# EAGLE schematic Drum_Machine (EAGLE 9.0.0)
REV: 00

## Sheet 1 of 7: PocketBeagle Connections
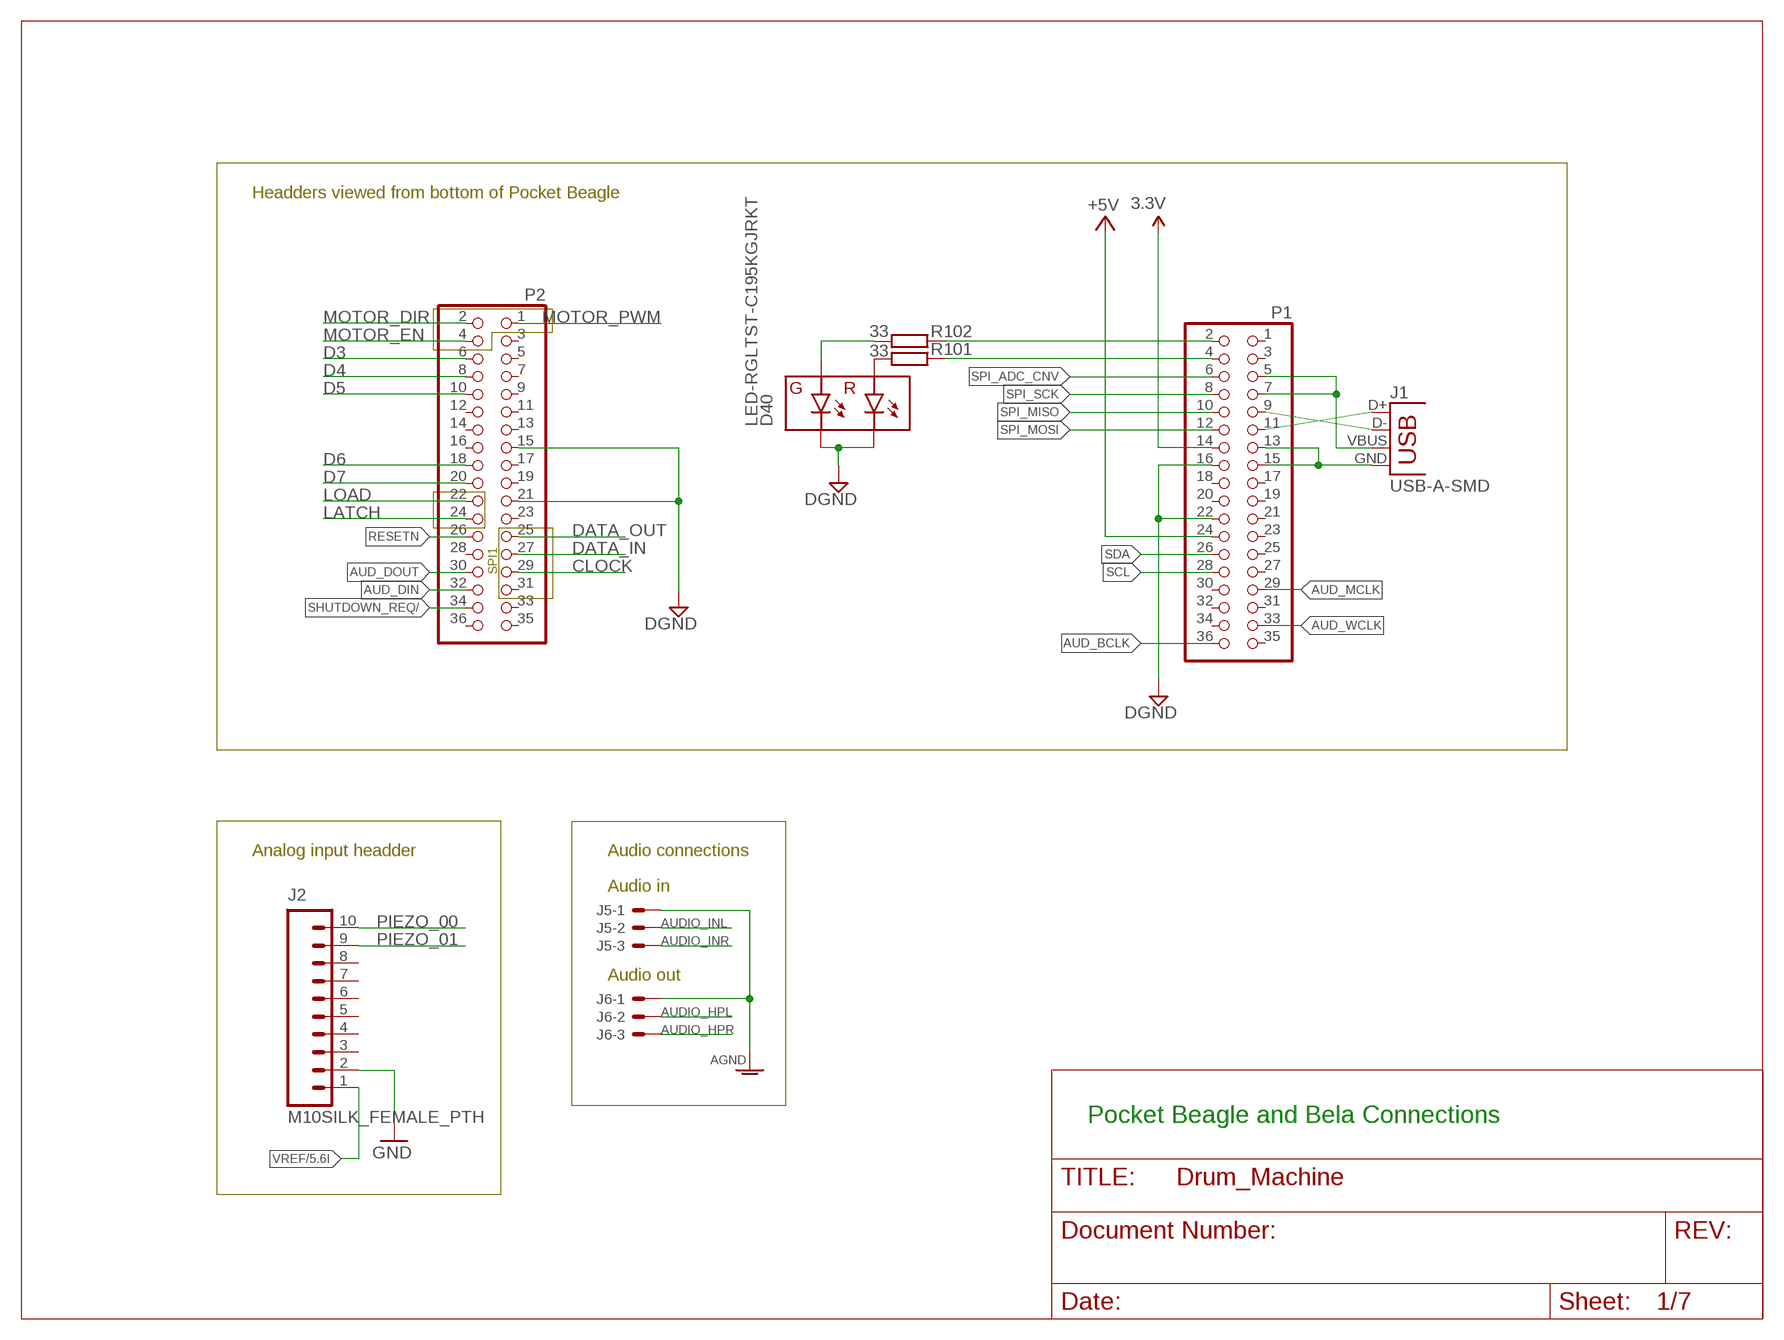
[diagram p0: schematic, sheet 1]

### Parts
D40  LED-RGLTST-C195KGJRKT  [LTST-C195KGJRKT]
J1  USB-A-SMD  [USB-A-S-NOSILK-FEMALE]
J2  M10SILK_FEMALE_PTH  [1X10]
J5  22-23-2031  [22-23-2031]
J6  22-23-2031  [22-23-2031]
P1  PINHD-2X18  [2X18]
P2  PINHD-2X18  [2X18]
R101  33  R-EU_R0603  [R0603]
R102  33  R-EU_R0603  [R0603]

### Nets
3.3V: P1.14 ; also sheet 2,3,4
+5V_SYS: P1.24 ; supply symbol labelled +5V
AUD_BCLK: P1.36
AUD_DIN: P2.32
AUD_DOUT: P2.30
AUD_MCLK: P1.29
AUD_WCLK: P1.33
AUDIO_HPL: J6.2
AUDIO_HPR: J6.3
AUDIO_INL: J5.2
AUDIO_INR: J5.3
CLOCK: P2.29 ; also sheet 2,3,4
D3: P2.6
D4: P2.8
D5: P2.10
D6: P2.18
D7: P2.20
DATA_IN: P2.27
DATA_OUT: P2.25 ; also sheet 2
GND: D40.P$3(GC) D40.P$4(RC) J2.2 J5.1 J6.1 P1.16 P1.22 P2.15 P2.21 ; supply symbol labelled DGND, AGND ; also sheet 2,3,4,5,6
LATCH: P2.24 ; also sheet 2,3
LOAD: P2.22
MOTOR_DIR: P2.2
MOTOR_EN: P2.4
MOTOR_PWM: P2.1
N$134: D40.P$2(RA) R101.2
N$135: D40.P$1(GA) R102.2
N$136: P1.4 R101.1
N$137: P1.2 R102.1
PIEZO_00: J2.10 ; also sheet 5
PIEZO_01: J2.9 ; also sheet 5
RESETN: P2.26
SCL: P1.28
SDA: P1.26
SHUTDOWN_REQ/: P2.34
SPI_ADC_CNV: P1.6
SPI_MISO: P1.10
SPI_MOSI: P1.12
SPI_SCK: P1.8
USB_DM1: J1.D- P1.9
USB_DP1: J1.D+ P1.11
USB_VBUS1: J1.VBUS P1.5 P1.7
USBGND1: J1.GND P1.13 P1.15
VREF: J2.1 ; also sheet 5
Unconnected: J2.3 J2.4 J2.5 J2.6 J2.7 J2.8 P1.1 P1.3 P1.17 P1.18 P1.19 P1.20 P1.21 P1.23 P1.25 P1.27 P1.30 P1.31 P1.32 P1.34 P1.35 P2.3 P2.5 P2.7 P2.9 P2.11 P2.12 P2.13 P2.14 P2.16 P2.17 P2.19 P2.23 P2.28 P2.31 P2.33 P2.35 P2.36

### Notes on the sheet
- Headders viewed from bottom of Pocket Beagle
- SPI1
- Analog input headder | Audio connections
- Audio in
- Audio out
- Pocket Beagle and Bela Connections

## Sheet 2 of 7: LED Matrix
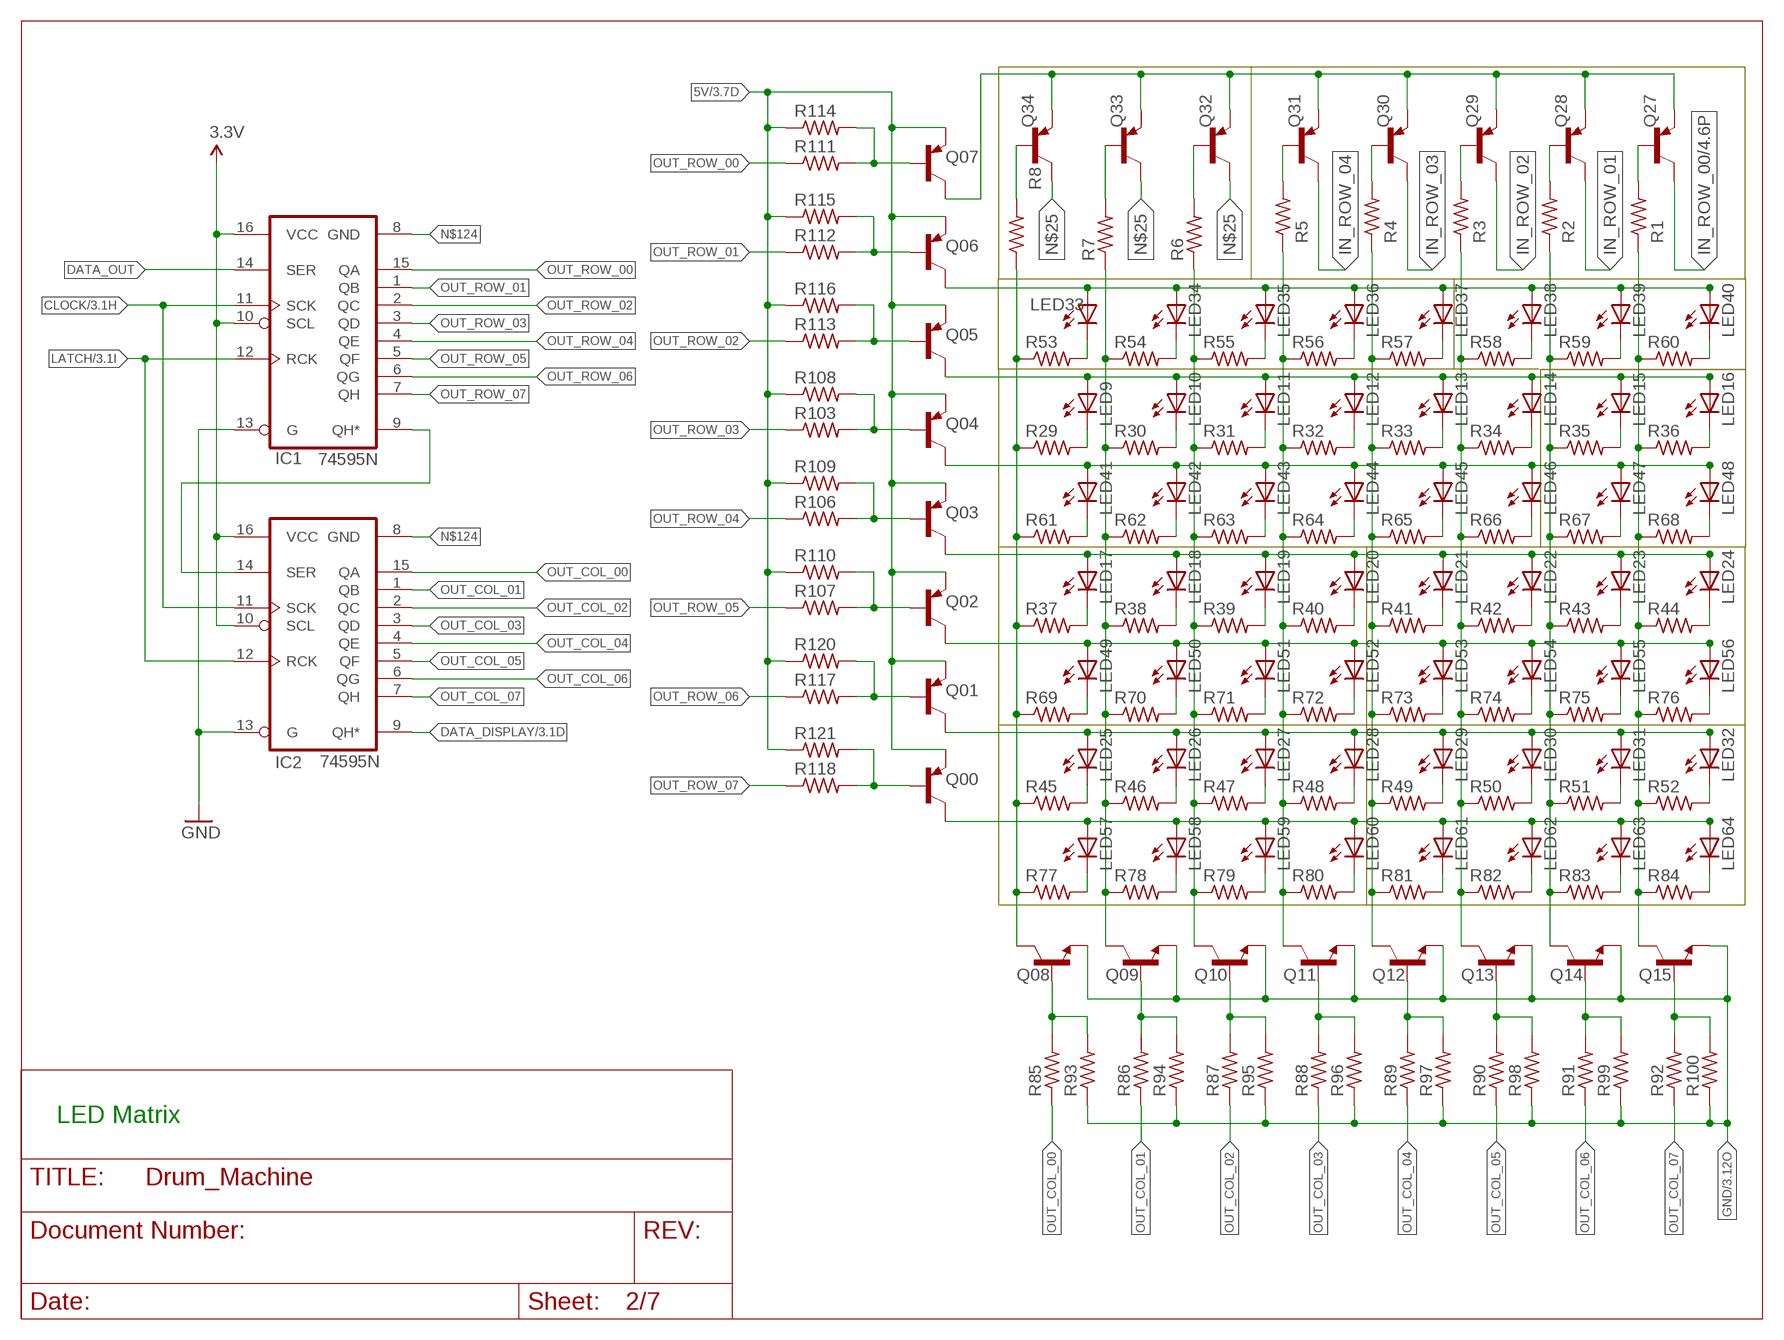
[diagram p1: schematic, sheet 2]

### Parts
IC1  74595N  [DIL16]
IC2  74595N  [DIL16]
LED9  LED5MM  [LED5MM]
LED10  LED5MM  [LED5MM]
LED11  LED5MM  [LED5MM]
LED12  LED5MM  [LED5MM]
LED13  LED5MM  [LED5MM]
LED14  LED5MM  [LED5MM]
LED15  LED5MM  [LED5MM]
LED16  LED5MM  [LED5MM]
LED17  LED5MM  [LED5MM]
LED18  LED5MM  [LED5MM]
LED19  LED5MM  [LED5MM]
LED20  LED5MM  [LED5MM]
LED21  LED5MM  [LED5MM]
LED22  LED5MM  [LED5MM]
LED23  LED5MM  [LED5MM]
LED24  LED5MM  [LED5MM]
LED25  LED5MM  [LED5MM]
LED26  LED5MM  [LED5MM]
LED27  LED5MM  [LED5MM]
LED28  LED5MM  [LED5MM]
LED29  LED5MM  [LED5MM]
LED30  LED5MM  [LED5MM]
LED31  LED5MM  [LED5MM]
LED32  LED5MM  [LED5MM]
LED33  LED5MM  [LED5MM]
LED34  LED5MM  [LED5MM]
LED35  LED5MM  [LED5MM]
LED36  LED5MM  [LED5MM]
LED37  LED5MM  [LED5MM]
LED38  LED5MM  [LED5MM]
LED39  LED5MM  [LED5MM]
LED40  LED5MM  [LED5MM]
LED41  LED5MM  [LED5MM]
LED42  LED5MM  [LED5MM]
LED43  LED5MM  [LED5MM]
LED44  LED5MM  [LED5MM]
LED45  LED5MM  [LED5MM]
LED46  LED5MM  [LED5MM]
LED47  LED5MM  [LED5MM]
LED48  LED5MM  [LED5MM]
LED49  LED5MM  [LED5MM]
LED50  LED5MM  [LED5MM]
LED51  LED5MM  [LED5MM]
LED52  LED5MM  [LED5MM]
LED53  LED5MM  [LED5MM]
LED54  LED5MM  [LED5MM]
LED55  LED5MM  [LED5MM]
LED56  LED5MM  [LED5MM]
LED57  LED5MM  [LED5MM]
LED58  LED5MM  [LED5MM]
LED59  LED5MM  [LED5MM]
LED60  LED5MM  [LED5MM]
LED61  LED5MM  [LED5MM]
LED62  LED5MM  [LED5MM]
LED63  LED5MM  [LED5MM]
LED64  LED5MM  [LED5MM]
Q00  BC857CSMD  [SOT23-BEC]
Q01  BC857CSMD  [SOT23-BEC]
Q02  BC857CSMD  [SOT23-BEC]
Q03  BC857CSMD  [SOT23-BEC]
Q04  BC857CSMD  [SOT23-BEC]
Q05  BC857CSMD  [SOT23-BEC]
Q06  BC857CSMD  [SOT23-BEC]
Q07  BC857CSMD  [SOT23-BEC]
Q08  2N4401-NPN-TO92-EBC  [TO92-EBC]
Q09  2N4401-NPN-TO92-EBC  [TO92-EBC]
Q10  2N4401-NPN-TO92-EBC  [TO92-EBC]
Q11  2N4401-NPN-TO92-EBC  [TO92-EBC]
Q12  2N4401-NPN-TO92-EBC  [TO92-EBC]
Q13  2N4401-NPN-TO92-EBC  [TO92-EBC]
Q14  2N4401-NPN-TO92-EBC  [TO92-EBC]
Q15  2N4401-NPN-TO92-EBC  [TO92-EBC]
Q27  BC857CSMD  [SOT23-BEC]
Q28  BC857CSMD  [SOT23-BEC]
Q29  BC857CSMD  [SOT23-BEC]
Q30  BC857CSMD  [SOT23-BEC]
Q31  BC857CSMD  [SOT23-BEC]
Q32  BC857CSMD  [SOT23-BEC]
Q33  BC857CSMD  [SOT23-BEC]
Q34  BC857CSMD  [SOT23-BEC]
R1  R-US_0309/10  [0309/10]
R2  R-US_0309/10  [0309/10]
R3  R-US_0309/10  [0309/10]
R4  R-US_0309/10  [0309/10]
R5  R-US_0309/10  [0309/10]
R6  R-US_0309/10  [0309/10]
R7  R-US_0309/10  [0309/10]
R8  R-US_0309/10  [0309/10]
R29  R-US_0309/10  [0309/10]
R30  R-US_0309/10  [0309/10]
R31  R-US_0309/10  [0309/10]
R32  R-US_0309/10  [0309/10]
R33  R-US_0309/10  [0309/10]
R34  R-US_0309/10  [0309/10]
R35  R-US_0309/10  [0309/10]
R36  R-US_0309/10  [0309/10]
R37  R-US_0309/10  [0309/10]
R38  R-US_0309/10  [0309/10]
R39  R-US_0309/10  [0309/10]
R40  R-US_0309/10  [0309/10]
R41  R-US_0309/10  [0309/10]
R42  R-US_0309/10  [0309/10]
R43  R-US_0309/10  [0309/10]
R44  R-US_0309/10  [0309/10]
R45  R-US_0309/10  [0309/10]
R46  R-US_0309/10  [0309/10]
R47  R-US_0309/10  [0309/10]
R48  R-US_0309/10  [0309/10]
R49  R-US_0309/10  [0309/10]
R50  R-US_0309/10  [0309/10]
R51  R-US_0309/10  [0309/10]
R52  R-US_0309/10  [0309/10]
R53  R-US_0309/10  [0309/10]
R54  R-US_0309/10  [0309/10]
R55  R-US_0309/10  [0309/10]
R56  R-US_0309/10  [0309/10]
R57  R-US_0309/10  [0309/10]
R58  R-US_0309/10  [0309/10]
R59  R-US_0309/10  [0309/10]
R60  R-US_0309/10  [0309/10]
R61  R-US_0309/10  [0309/10]
R62  R-US_0309/10  [0309/10]
R63  R-US_0309/10  [0309/10]
R64  R-US_0309/10  [0309/10]
R65  R-US_0309/10  [0309/10]
R66  R-US_0309/10  [0309/10]
R67  R-US_0309/10  [0309/10]
R68  R-US_0309/10  [0309/10]
R69  R-US_0309/10  [0309/10]
R70  R-US_0309/10  [0309/10]
R71  R-US_0309/10  [0309/10]
R72  R-US_0309/10  [0309/10]
R73  R-US_0309/10  [0309/10]
R74  R-US_0309/10  [0309/10]
R75  R-US_0309/10  [0309/10]
R76  R-US_0309/10  [0309/10]
R77  R-US_0309/10  [0309/10]
R78  R-US_0309/10  [0309/10]
R79  R-US_0309/10  [0309/10]
R80  R-US_0309/10  [0309/10]
R81  R-US_0309/10  [0309/10]
R82  R-US_0309/10  [0309/10]
R83  R-US_0309/10  [0309/10]
R84  R-US_0309/10  [0309/10]
R85  R-US_0309/10  [0309/10]
R86  R-US_0309/10  [0309/10]
R87  R-US_0309/10  [0309/10]
R88  R-US_0309/10  [0309/10]
R89  R-US_0309/10  [0309/10]
R90  R-US_0309/10  [0309/10]
R91  R-US_0309/10  [0309/10]
R92  R-US_0309/10  [0309/10]
R93  R-US_0309/10  [0309/10]
R94  R-US_0309/10  [0309/10]
R95  R-US_0309/10  [0309/10]
R96  R-US_0309/10  [0309/10]
R97  R-US_0309/10  [0309/10]
R98  R-US_0309/10  [0309/10]
R99  R-US_0309/10  [0309/10]
R100  R-US_0309/10  [0309/10]
R103  R-US_0309/10  [0309/10]
R106  R-US_0309/10  [0309/10]
R107  R-US_0309/10  [0309/10]
R108  R-US_0309/10  [0309/10]
R109  R-US_0309/10  [0309/10]
R110  R-US_0309/10  [0309/10]
R111  R-US_0309/10  [0309/10]
R112  R-US_0309/10  [0309/10]
R113  R-US_0309/10  [0309/10]
R114  R-US_0309/10  [0309/10]
R115  R-US_0309/10  [0309/10]
R116  R-US_0309/10  [0309/10]
R117  R-US_0309/10  [0309/10]
R118  R-US_0309/10  [0309/10]
R120  R-US_0309/10  [0309/10]
R121  R-US_0309/10  [0309/10]

### Nets
3.3V: IC1.10(SCL) IC1.16(VCC) IC2.10(SCL) IC2.16(VCC) ; also sheet 1,3,4
5V: Q00.E Q01.E Q02.E Q03.E Q04.E Q05.E Q06.E Q07.E R108.1 R109.1 R110.1 R114.1 R115.1 R116.1 R120.1 R121.1 ; also sheet 3
4445: Q06.B R112.2 R115.2
CLOCK: IC1.11(SCK) IC2.11(SCK) ; also sheet 1,3,4
DATA_DISPLAY: IC2.9(QH*) ; also sheet 3
DATA_OUT: IC1.14(SER) ; also sheet 1
GND: IC1.13(G) IC2.13(G) Q08.E Q09.E Q10.E Q11.E Q12.E Q13.E Q14.E Q15.E R93.1 R94.1 R95.1 R96.1 R97.1 R98.1 R99.1 R100.1 ; also sheet 1,3,4,5,6
IN_ROW_00: Q27.C ; also sheet 4
IN_ROW_01: Q28.C ; also sheet 4
IN_ROW_02: Q29.C ; also sheet 4
IN_ROW_03: Q30.C ; also sheet 4
IN_ROW_04: Q31.C ; also sheet 4
LATCH: IC1.12(RCK) IC2.12(RCK) ; also sheet 1,3
N$22: Q27.B R1.2
N$23: Q07.C Q27.E Q28.E Q29.E Q30.E Q31.E Q32.E Q33.E Q34.E
N$24: Q28.B R2.2
N$25: Q32.C Q33.C Q34.C
N$26: Q29.B R3.2
N$27: Q30.B R4.2
N$29: Q31.B R5.2
N$34: Q32.B R6.2
N$36: Q33.B R7.2
N$37: LED9.A LED10.A LED11.A LED12.A LED13.A LED14.A LED15.A LED16.A Q05.C
N$40: Q34.B R8.2
N$41: LED9.K(C) R29.2
N$43: LED10.K(C) R30.2
N$45: LED11.K(C) R31.2
N$47: LED12.K(C) R32.2
N$49: LED13.K(C) R33.2
N$51: LED14.K(C) R34.2
N$59: LED15.K(C) R35.2
N$60: LED16.K(C) R36.2
N$61: LED17.A LED18.A LED19.A LED20.A LED21.A LED22.A LED23.A LED24.A Q03.C
N$62: LED17.K(C) R37.2
N$63: LED18.K(C) R38.2
N$64: LED19.K(C) R39.2
N$65: LED20.K(C) R40.2
N$66: LED21.K(C) R41.2
N$67: LED22.K(C) R42.2
N$68: LED23.K(C) R43.2
N$69: LED24.K(C) R44.2
N$70: LED25.A LED26.A LED27.A LED28.A LED29.A LED30.A LED31.A LED32.A Q01.C
N$71: LED25.K(C) R45.2
N$72: LED26.K(C) R46.2
N$73: LED27.K(C) R47.2
N$74: LED28.K(C) R48.2
N$75: LED29.K(C) R49.2
N$76: LED30.K(C) R50.2
N$77: LED31.K(C) R51.2
N$78: LED32.K(C) R52.2
N$79: LED33.A LED34.A LED35.A LED36.A LED37.A LED38.A LED39.A LED40.A Q06.C
N$80: LED33.K(C) R53.2
N$81: LED34.K(C) R54.2
N$82: LED35.K(C) R55.2
N$83: LED36.K(C) R56.2
N$84: LED37.K(C) R57.2
N$85: LED38.K(C) R58.2
N$86: LED39.K(C) R59.2
N$87: LED40.K(C) R60.2
N$88: LED41.A LED42.A LED43.A LED44.A LED45.A LED46.A LED47.A LED48.A Q04.C
N$89: LED41.K(C) R61.2
N$90: LED42.K(C) R62.2
N$91: LED43.K(C) R63.2
N$92: LED44.K(C) R64.2
N$93: LED45.K(C) R65.2
N$94: LED46.K(C) R66.2
N$95: LED47.K(C) R67.2
N$96: LED48.K(C) R68.2
N$97: LED49.A LED50.A LED51.A LED52.A LED53.A LED54.A LED55.A LED56.A Q02.C
N$98: LED49.K(C) R69.2
N$99: LED50.K(C) R70.2
N$100: LED51.K(C) R71.2
N$101: LED52.K(C) R72.2
N$102: LED53.K(C) R73.2
N$103: LED54.K(C) R74.2
N$104: LED55.K(C) R75.2
N$105: LED56.K(C) R76.2
N$106: LED57.A LED58.A LED59.A LED60.A LED61.A LED62.A LED63.A LED64.A Q00.C
N$107: LED57.K(C) R77.2
N$108: LED58.K(C) R78.2
N$109: LED59.K(C) R79.2
N$110: LED60.K(C) R80.2
N$111: LED61.K(C) R81.2
N$112: LED62.K(C) R82.2
N$113: LED63.K(C) R83.2
N$114: LED64.K(C) R84.2
N$115: Q08.C R8.1 R29.1 R37.1 R45.1 R53.1 R61.1 R69.1 R77.1
N$116: Q09.C R7.1 R30.1 R38.1 R46.1 R54.1 R62.1 R70.1 R78.1
N$117: Q10.C R6.1 R31.1 R39.1 R47.1 R55.1 R63.1 R71.1 R79.1
N$118: Q11.C R5.1 R32.1 R40.1 R48.1 R56.1 R64.1 R72.1 R80.1
N$119: Q12.C R4.1 R33.1 R41.1 R49.1 R57.1 R65.1 R73.1 R81.1
N$120: Q13.C R3.1 R34.1 R42.1 R50.1 R58.1 R66.1 R74.1 R82.1
N$121: Q14.C R2.1 R35.1 R43.1 R51.1 R59.1 R67.1 R75.1 R83.1
N$122: Q15.C R1.1 R36.1 R44.1 R52.1 R60.1 R68.1 R76.1 R84.1
N$123: Q08.B R85.2 R93.2
N$124: IC1.8(GND) IC2.8(GND)
N$125: Q09.B R86.2 R94.2
N$126: Q10.B R87.2 R95.2
N$127: Q11.B R88.2 R96.2
N$128: Q12.B R89.2 R97.2
N$129: Q13.B R90.2 R98.2
N$130: Q14.B R91.2 R99.2
N$131: Q15.B R92.2 R100.2
N$132: IC1.9(QH*) IC2.14(SER)
N$133: Q04.B R103.2 R108.2
N$138: Q03.B R106.2 R109.2
N$139: Q02.B R107.2 R110.2
N$140: Q07.B R111.2 R114.2
N$142: Q05.B R113.2 R116.2
N$143: Q01.B R117.2 R120.2
N$144: Q00.B R118.2 R121.2
OUT_COL_00: IC2.15(QA) R85.1
OUT_COL_01: IC2.1(QB) R86.1
OUT_COL_02: IC2.2(QC) R87.1
OUT_COL_03: IC2.3(QD) R88.1
OUT_COL_04: IC2.4(QE) R89.1
OUT_COL_05: IC2.5(QF) R90.1
OUT_COL_06: IC2.6(QG) R91.1
OUT_COL_07: IC2.7(QH) R92.1
OUT_ROW_00: IC1.15(QA) R111.1
OUT_ROW_01: IC1.1(QB) R112.1
OUT_ROW_02: IC1.2(QC) R113.1
OUT_ROW_03: IC1.3(QD) R103.1
OUT_ROW_04: IC1.4(QE) R106.1
OUT_ROW_05: IC1.5(QF) R107.1
OUT_ROW_06: IC1.6(QG) R117.1
OUT_ROW_07: IC1.7(QH) R118.1

### Notes on the sheet
- LED Matrix

## Sheet 3 of 7: Numeric Display
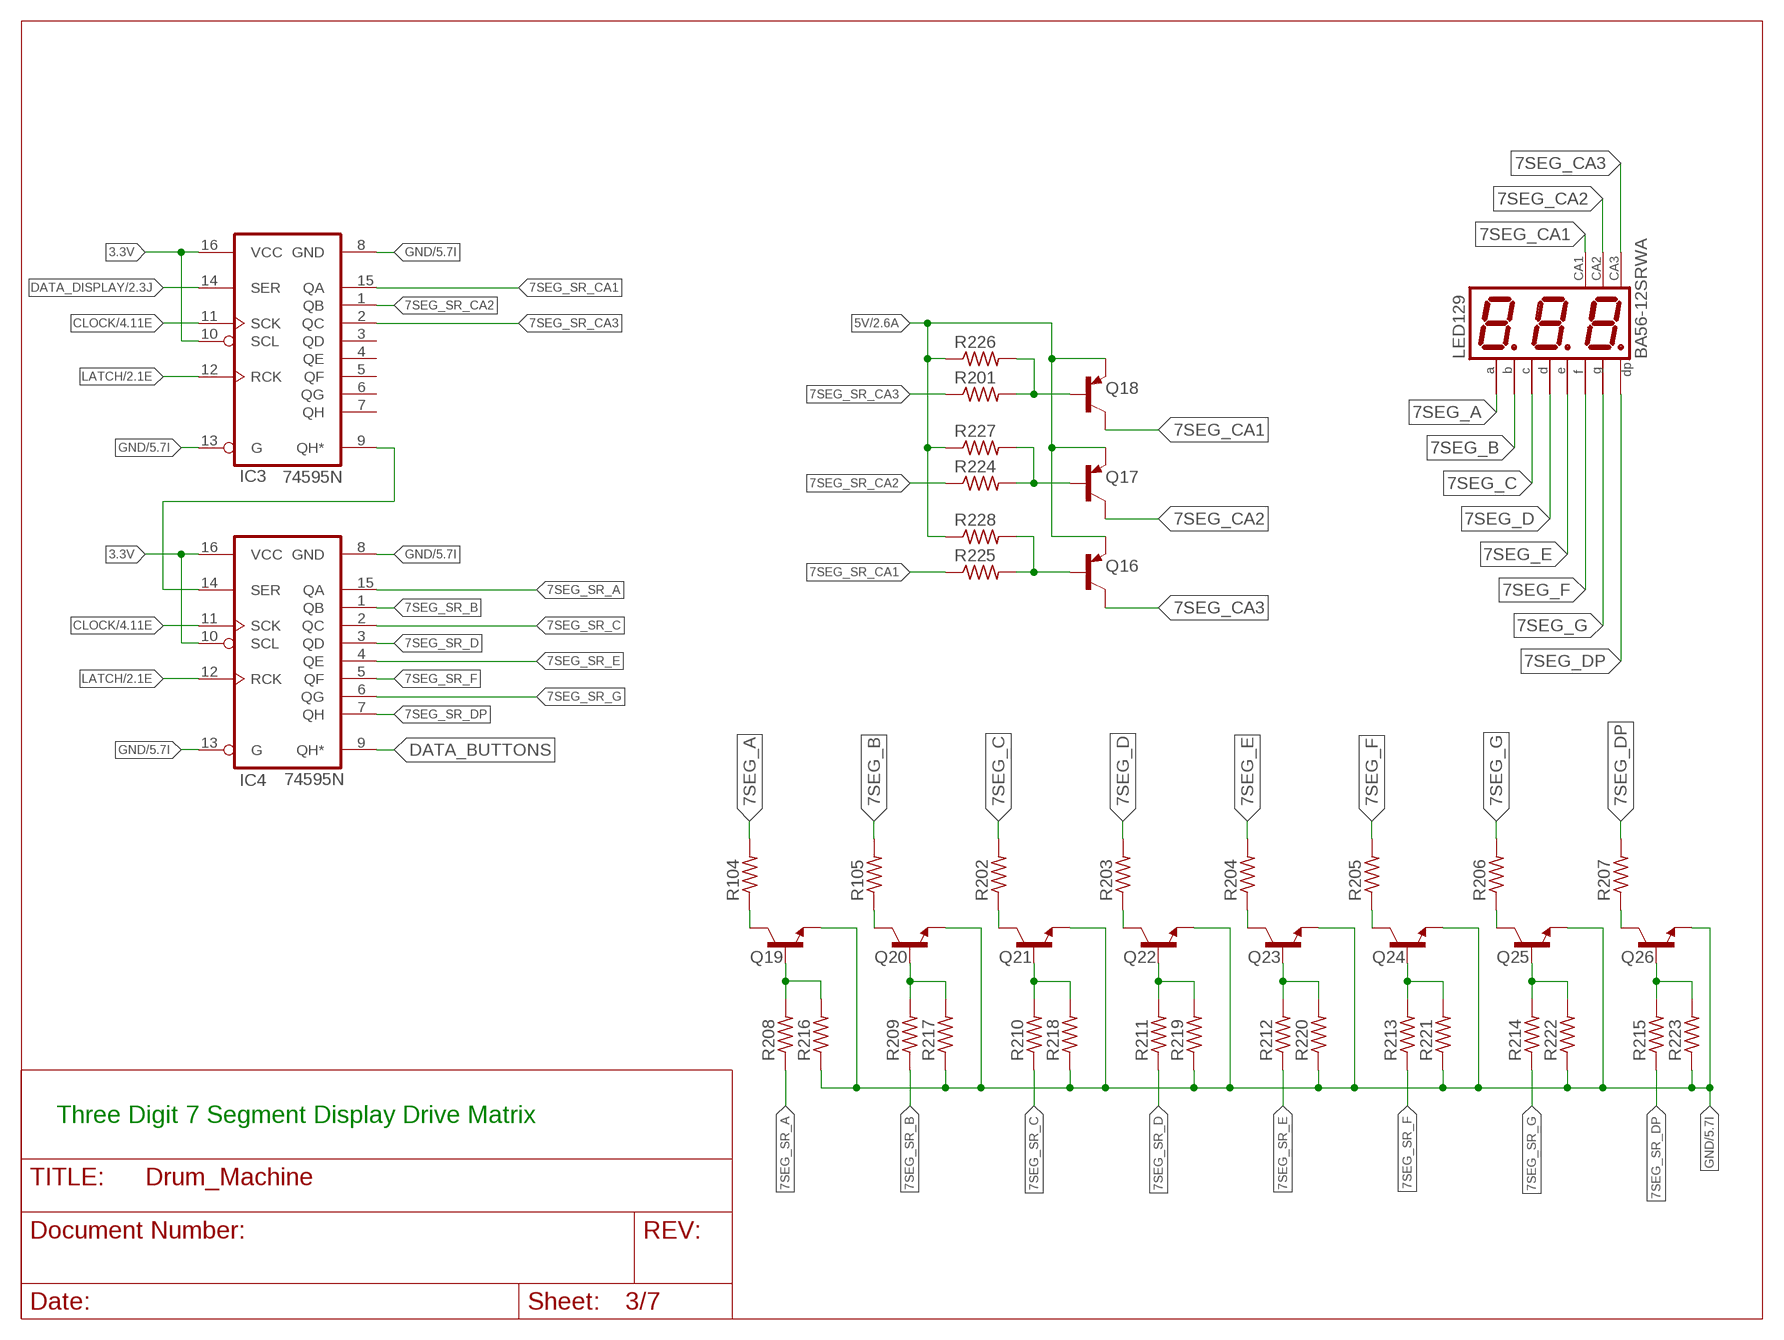
[diagram p2: schematic, sheet 3]

### Parts
IC3  74595N  [DIL16]
IC4  74595N  [DIL16]
LED129  BA56-12SRWA  [BX56-12]
Q16  BC857CSMD  [SOT23-BEC]
Q17  BC857CSMD  [SOT23-BEC]
Q18  BC857CSMD  [SOT23-BEC]
Q19  2N4401-NPN-TO92-EBC  [TO92-EBC]
Q20  2N4401-NPN-TO92-EBC  [TO92-EBC]
Q21  2N4401-NPN-TO92-EBC  [TO92-EBC]
Q22  2N4401-NPN-TO92-EBC  [TO92-EBC]
Q23  2N4401-NPN-TO92-EBC  [TO92-EBC]
Q24  2N4401-NPN-TO92-EBC  [TO92-EBC]
Q25  2N4401-NPN-TO92-EBC  [TO92-EBC]
Q26  2N4401-NPN-TO92-EBC  [TO92-EBC]
R104  R-US_0309/10  [0309/10]
R105  R-US_0309/10  [0309/10]
R201  R-US_0309/10  [0309/10]
R202  R-US_0309/10  [0309/10]
R203  R-US_0309/10  [0309/10]
R204  R-US_0309/10  [0309/10]
R205  R-US_0309/10  [0309/10]
R206  R-US_0309/10  [0309/10]
R207  R-US_0309/10  [0309/10]
R208  R-US_0309/10  [0309/10]
R209  R-US_0309/10  [0309/10]
R210  R-US_0309/10  [0309/10]
R211  R-US_0309/10  [0309/10]
R212  R-US_0309/10  [0309/10]
R213  R-US_0309/10  [0309/10]
R214  R-US_0309/10  [0309/10]
R215  R-US_0309/10  [0309/10]
R216  R-US_0309/10  [0309/10]
R217  R-US_0309/10  [0309/10]
R218  R-US_0309/10  [0309/10]
R219  R-US_0309/10  [0309/10]
R220  R-US_0309/10  [0309/10]
R221  R-US_0309/10  [0309/10]
R222  R-US_0309/10  [0309/10]
R223  R-US_0309/10  [0309/10]
R224  R-US_0309/10  [0309/10]
R225  R-US_0309/10  [0309/10]
R226  R-US_0309/10  [0309/10]
R227  R-US_0309/10  [0309/10]
R228  R-US_0309/10  [0309/10]

### Nets
3.3V: IC3.10(SCL) IC3.16(VCC) IC4.10(SCL) IC4.16(VCC) ; also sheet 1,2,4
5V: Q16.E Q17.E Q18.E R226.1 R227.1 R228.1 ; also sheet 2
7SEG_A: LED129.11(A) R104.2
7SEG_B: LED129.7(B) R105.2
7SEG_C: LED129.4(C) R202.2
7SEG_CA1: LED129.12(CA) Q18.C
7SEG_CA2: LED129.9(CA) Q17.C
7SEG_CA3: LED129.8(CA) Q16.C
7SEG_D: LED129.2(D) R203.2
7SEG_DP: LED129.3(DP) R207.2
7SEG_E: LED129.1(E) R204.2
7SEG_F: LED129.10(F) R205.2
7SEG_G: LED129.5(G) R206.2
7SEG_SR_A: IC4.15(QA) R208.1
7SEG_SR_B: IC4.1(QB) R209.1
7SEG_SR_C: IC4.2(QC) R210.1
7SEG_SR_CA1: IC3.15(QA) R225.1
7SEG_SR_CA2: IC3.1(QB) R224.1
7SEG_SR_CA3: IC3.2(QC) R201.1
7SEG_SR_D: IC4.3(QD) R211.1
7SEG_SR_DP: IC4.7(QH) R215.1
7SEG_SR_E: IC4.4(QE) R212.1
7SEG_SR_F: IC4.5(QF) R213.1
7SEG_SR_G: IC4.6(QG) R214.1
CLOCK: IC3.11(SCK) IC4.11(SCK) ; also sheet 1,2,4
DATA_BUTTONS: IC4.9(QH*)
DATA_DISPLAY: IC3.14(SER) ; also sheet 2
GND: IC3.8(GND) IC3.13(G) IC4.8(GND) IC4.13(G) Q19.E Q20.E Q21.E Q22.E Q23.E Q24.E Q25.E Q26.E R216.1 R217.1 R218.1 R219.1 R220.1 R221.1 R222.1 R223.1 ; also sheet 1,2,4,5,6
LATCH: IC3.12(RCK) IC4.12(RCK) ; also sheet 1,2
N$33: IC3.9(QH*) IC4.14(SER)
N$238: Q18.B R201.2 R226.2
N$241: Q19.C R104.1
N$242: Q20.C R105.1
N$243: Q21.C R202.1
N$244: Q22.C R203.1
N$245: Q23.C R204.1
N$246: Q24.C R205.1
N$247: Q25.C R206.1
N$248: Q26.C R207.1
N$249: Q19.B R208.2 R216.2
N$250: Q20.B R209.2 R217.2
N$251: Q21.B R210.2 R218.2
N$252: Q22.B R211.2 R219.2
N$253: Q23.B R212.2 R220.2
N$254: Q24.B R213.2 R221.2
N$255: Q25.B R214.2 R222.2
N$256: Q26.B R215.2 R223.2
N$258: Q17.B R224.2 R227.2
N$259: Q16.B R225.2 R228.2
Unconnected: IC3.3(QD) IC3.4(QE) IC3.5(QF) IC3.6(QG) IC3.7(QH)

### Notes on the sheet
- Three Digit 7 Segment Display Drive Matrix

## Sheet 4 of 7: Button Matrix
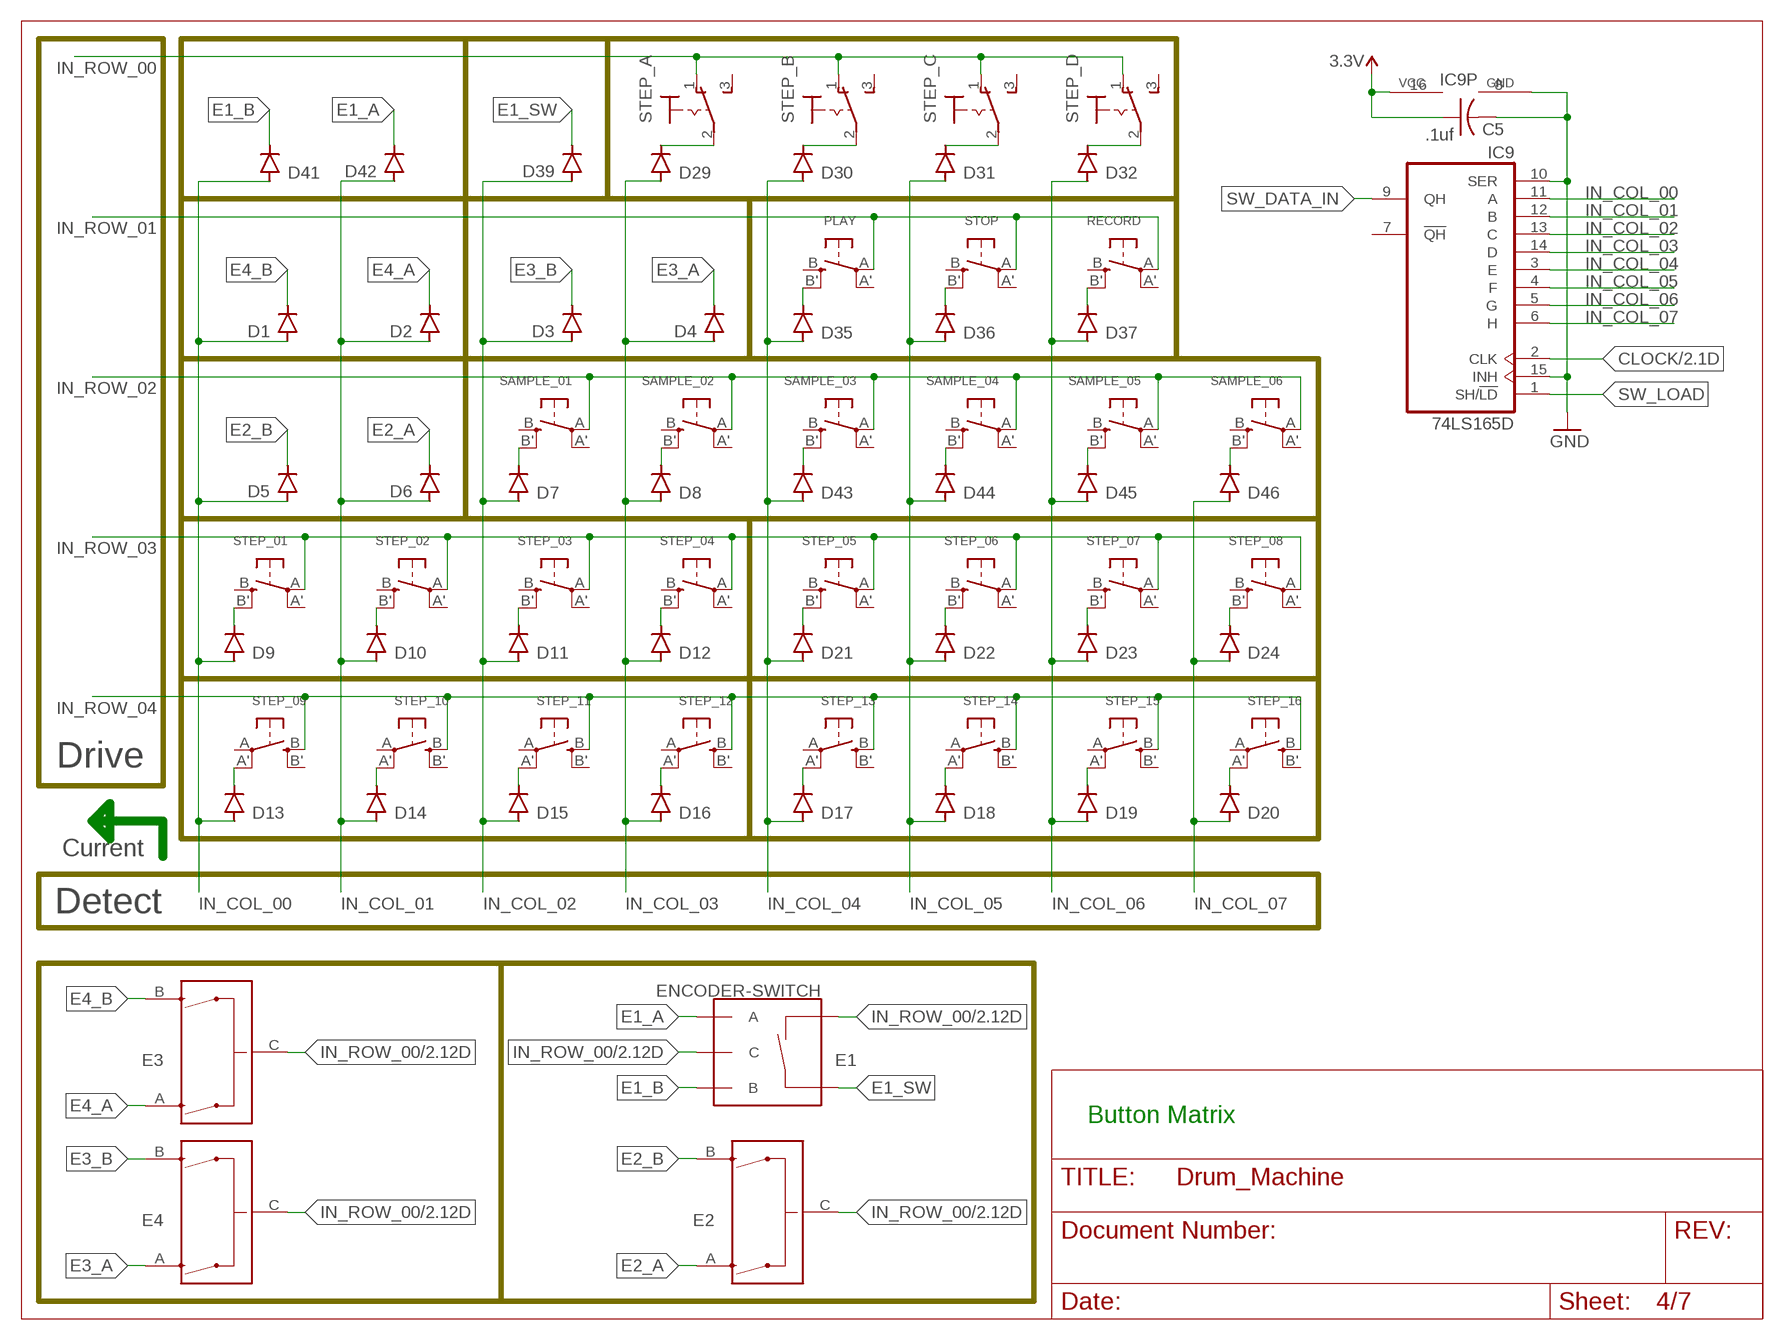
[diagram p3: schematic, sheet 4]

### Parts
C5  .1uf  C-USC0805  [C0805]
D1  PMLL4150  [SOD80C@1]
D2  PMLL4150  [SOD80C@1]
D3  PMLL4150  [SOD80C@1]
D4  PMLL4150  [SOD80C@1]
D5  PMLL4150  [SOD80C@1]
D6  PMLL4150  [SOD80C@1]
D7  PMLL4150  [SOD80C@1]
D8  PMLL4150  [SOD80C@1]
D9  PMLL4150  [SOD80C@1]
D10  PMLL4150  [SOD80C@1]
D11  PMLL4150  [SOD80C@1]
D12  PMLL4150  [SOD80C@1]
D13  PMLL4150  [SOD80C@1]
D14  PMLL4150  [SOD80C@1]
D15  PMLL4150  [SOD80C@1]
D16  PMLL4150  [SOD80C@1]
D17  PMLL4150  [SOD80C@1]
D18  PMLL4150  [SOD80C@1]
D19  PMLL4150  [SOD80C@1]
D20  PMLL4150  [SOD80C@1]
D21  PMLL4150  [SOD80C@1]
D22  PMLL4150  [SOD80C@1]
D23  PMLL4150  [SOD80C@1]
D24  PMLL4150  [SOD80C@1]
D29  PMLL4150  [SOD80C@1]
D30  PMLL4150  [SOD80C@1]
D31  PMLL4150  [SOD80C@1]
D32  PMLL4150  [SOD80C@1]
D35  PMLL4150  [SOD80C@1]
D36  PMLL4150  [SOD80C@1]
D37  PMLL4150  [SOD80C@1]
D39  PMLL4150  [SOD80C@1]
D41  PMLL4150  [SOD80C@1]
D42  PMLL4150  [SOD80C@1]
D43  PMLL4150  [SOD80C@1]
D44  PMLL4150  [SOD80C@1]
D45  PMLL4150  [SOD80C@1]
D46  PMLL4150  [SOD80C@1]
E1  ENCODER-SWITCH  [ROTARY_ENC_PLAIN]
E2  ENCODER  [ENCODER-16MM-QUAD]
E3  ENCODER  [ENCODER-16MM-QUAD]
E4  ENCODER  [ENCODER-16MM-QUAD]
IC9  74LS165D  [SO16]
PLAY  SWITCH_TACT_SMT  [EVQ-Q2]
RECORD  SWITCH_TACT_SMT  [EVQ-Q2]
SAMPLE_01  SWITCH_TACT_SMT  [EVQ-Q2]
SAMPLE_02  SWITCH_TACT_SMT  [EVQ-Q2]
SAMPLE_03  SWITCH_TACT_SMT  [EVQ-Q2]
SAMPLE_04  SWITCH_TACT_SMT  [EVQ-Q2]
SAMPLE_05  SWITCH_TACT_SMT  [EVQ-Q2]
SAMPLE_06  SWITCH_TACT_SMT  [EVQ-Q2]
STEP_01  SWITCH_TACT_SMT  [EVQ-Q2]
STEP_02  SWITCH_TACT_SMT  [EVQ-Q2]
STEP_03  SWITCH_TACT_SMT  [EVQ-Q2]
STEP_04  SWITCH_TACT_SMT  [EVQ-Q2]
STEP_05  SWITCH_TACT_SMT  [EVQ-Q2]
STEP_06  SWITCH_TACT_SMT  [EVQ-Q2]
STEP_07  SWITCH_TACT_SMT  [EVQ-Q2]
STEP_08  SWITCH_TACT_SMT  [EVQ-Q2]
STEP_09  SWITCH_TACT_SMT  [EVQ-Q2]
STEP_10  SWITCH_TACT_SMT  [EVQ-Q2]
STEP_11  SWITCH_TACT_SMT  [EVQ-Q2]
STEP_12  SWITCH_TACT_SMT  [EVQ-Q2]
STEP_13  SWITCH_TACT_SMT  [EVQ-Q2]
STEP_14  SWITCH_TACT_SMT  [EVQ-Q2]
STEP_15  SWITCH_TACT_SMT  [EVQ-Q2]
STEP_16  SWITCH_TACT_SMT  [EVQ-Q2]
STEP_A  320-916  [320-916]
STEP_B  320-916  [320-916]
STEP_C  320-916  [320-916]
STEP_D  320-916  [320-916]
STOP  SWITCH_TACT_SMT  [EVQ-Q2]

### Nets
3.3V: C5.1 IC9.16(VCC) ; also sheet 1,2,3
CLOCK: IC9.2(CLK) ; also sheet 1,2,3
E1_A: D42.C E1.A
E1_B: D41.C E1.B
E1_SW: D39.C E1.SW+
E2_A: D6.C E2.A
E2_B: D5.C E2.B
E3_A: D4.C E4.A
E3_B: D3.C E4.B
E4_A: D2.C E3.A
E4_B: D1.C E3.B
GND: C5.2 IC9.8(GND) IC9.10(SER) IC9.15(INH) ; also sheet 1,2,3,5,6
IN_COL_00: D1.A D5.A D9.A D13.A D41.A IC9.11(A)
IN_COL_01: D2.A D6.A D10.A D14.A D42.A IC9.12(B)
IN_COL_02: D3.A D7.A D11.A D15.A D39.A IC9.13(C)
IN_COL_03: D4.A D8.A D12.A D16.A D29.A IC9.14(D)
IN_COL_04: D17.A D21.A D30.A D35.A D43.A IC9.3(E)
IN_COL_05: D18.A D22.A D31.A D36.A D44.A IC9.4(F)
IN_COL_06: D19.A D23.A D32.A D37.A D45.A IC9.5(G)
IN_COL_07: D20.A D24.A D46.A IC9.6(H)
IN_ROW_00: E1.C E1.SW- E2.C E3.C E4.C STEP_A.1(O) STEP_B.1(O) STEP_C.1(O) STEP_D.1(O) ; also sheet 2
IN_ROW_01: PLAY.A(P) RECORD.A(P) STOP.A(P) ; also sheet 2
IN_ROW_02: SAMPLE_01.A(P) SAMPLE_02.A(P) SAMPLE_03.A(P) SAMPLE_04.A(P) SAMPLE_05.A(P) SAMPLE_06.A(P) ; also sheet 2
IN_ROW_03: STEP_01.A(P) STEP_02.A(P) STEP_03.A(P) STEP_04.A(P) STEP_05.A(P) STEP_06.A(P) STEP_07.A(P) STEP_08.A(P) ; also sheet 2
IN_ROW_04: STEP_09.B(S) STEP_10.B(S) STEP_11.B(S) STEP_12.B(S) STEP_13.B(S) STEP_14.B(S) STEP_15.B(S) STEP_16.B(S) ; also sheet 2
N$2: D29.C STEP_A.2(P)
N$3: D16.C STEP_12.A'(P1)
N$4: D17.C STEP_13.A'(P1)
N$5: D18.C STEP_14.A'(P1)
N$6: D15.C STEP_11.A'(P1)
N$7: D14.C STEP_10.A'(P1)
N$8: D13.C STEP_09.A'(P1)
N$9: D19.C STEP_15.A'(P1)
N$10: D20.C STEP_16.A'(P1)
N$11: D30.C STEP_B.2(P)
N$12: D9.C STEP_01.B'(S1)
N$13: D10.C STEP_02.B'(S1)
N$14: D11.C STEP_03.B'(S1)
N$15: D12.C STEP_04.B'(S1)
N$16: D21.C STEP_05.B'(S1)
N$17: D22.C STEP_06.B'(S1)
N$18: D23.C STEP_07.B'(S1)
N$19: D24.C STEP_08.B'(S1)
N$20: D31.C STEP_C.2(P)
N$21: D32.C STEP_D.2(P)
N$28: D35.C PLAY.B'(S1)
N$31: D37.C RECORD.B'(S1)
N$32: D36.C STOP.B'(S1)
N$58: D7.C SAMPLE_01.B'(S1)
N$145: D8.C SAMPLE_02.B'(S1)
N$146: D43.C SAMPLE_03.B'(S1)
N$147: D44.C SAMPLE_04.B'(S1)
N$148: D45.C SAMPLE_05.B'(S1)
N$149: D46.C SAMPLE_06.B'(S1)
SW_DATA_IN: IC9.9(QH)
SW_LOAD: IC9.1(SH/!LD)
Unconnected: IC9.7(!QH) PLAY.A'(P1) PLAY.B(S) RECORD.A'(P1) RECORD.B(S) SAMPLE_01.A'(P1) SAMPLE_01.B(S) SAMPLE_02.A'(P1) SAMPLE_02.B(S) SAMPLE_03.A'(P1) SAMPLE_03.B(S) SAMPLE_04.A'(P1) SAMPLE_04.B(S) SAMPLE_05.A'(P1) SAMPLE_05.B(S) SAMPLE_06.A'(P1) SAMPLE_06.B(S) STEP_01.A'(P1) STEP_01.B(S) STEP_02.A'(P1) STEP_02.B(S) STEP_03.A'(P1) STEP_03.B(S) STEP_04.A'(P1) STEP_04.B(S) STEP_05.A'(P1) STEP_05.B(S) STEP_06.A'(P1) STEP_06.B(S) STEP_07.A'(P1) STEP_07.B(S) STEP_08.A'(P1) STEP_08.B(S) STEP_09.A(P) STEP_09.B'(S1) STEP_10.A(P) STEP_10.B'(S1) STEP_11.A(P) STEP_11.B'(S1) STEP_12.A(P) STEP_12.B'(S1) STEP_13.A(P) STEP_13.B'(S1) STEP_14.A(P) STEP_14.B'(S1) STEP_15.A(P) STEP_15.B'(S1) STEP_16.A(P) STEP_16.B'(S1) STEP_A.3(S) STEP_B.3(S) STEP_C.3(S) STEP_D.3(S) STOP.A'(P1) STOP.B(S)

### Notes on the sheet
- Drive
- Current
- Detect
- Button Matrix

## Sheet 5 of 7: Drum Pads
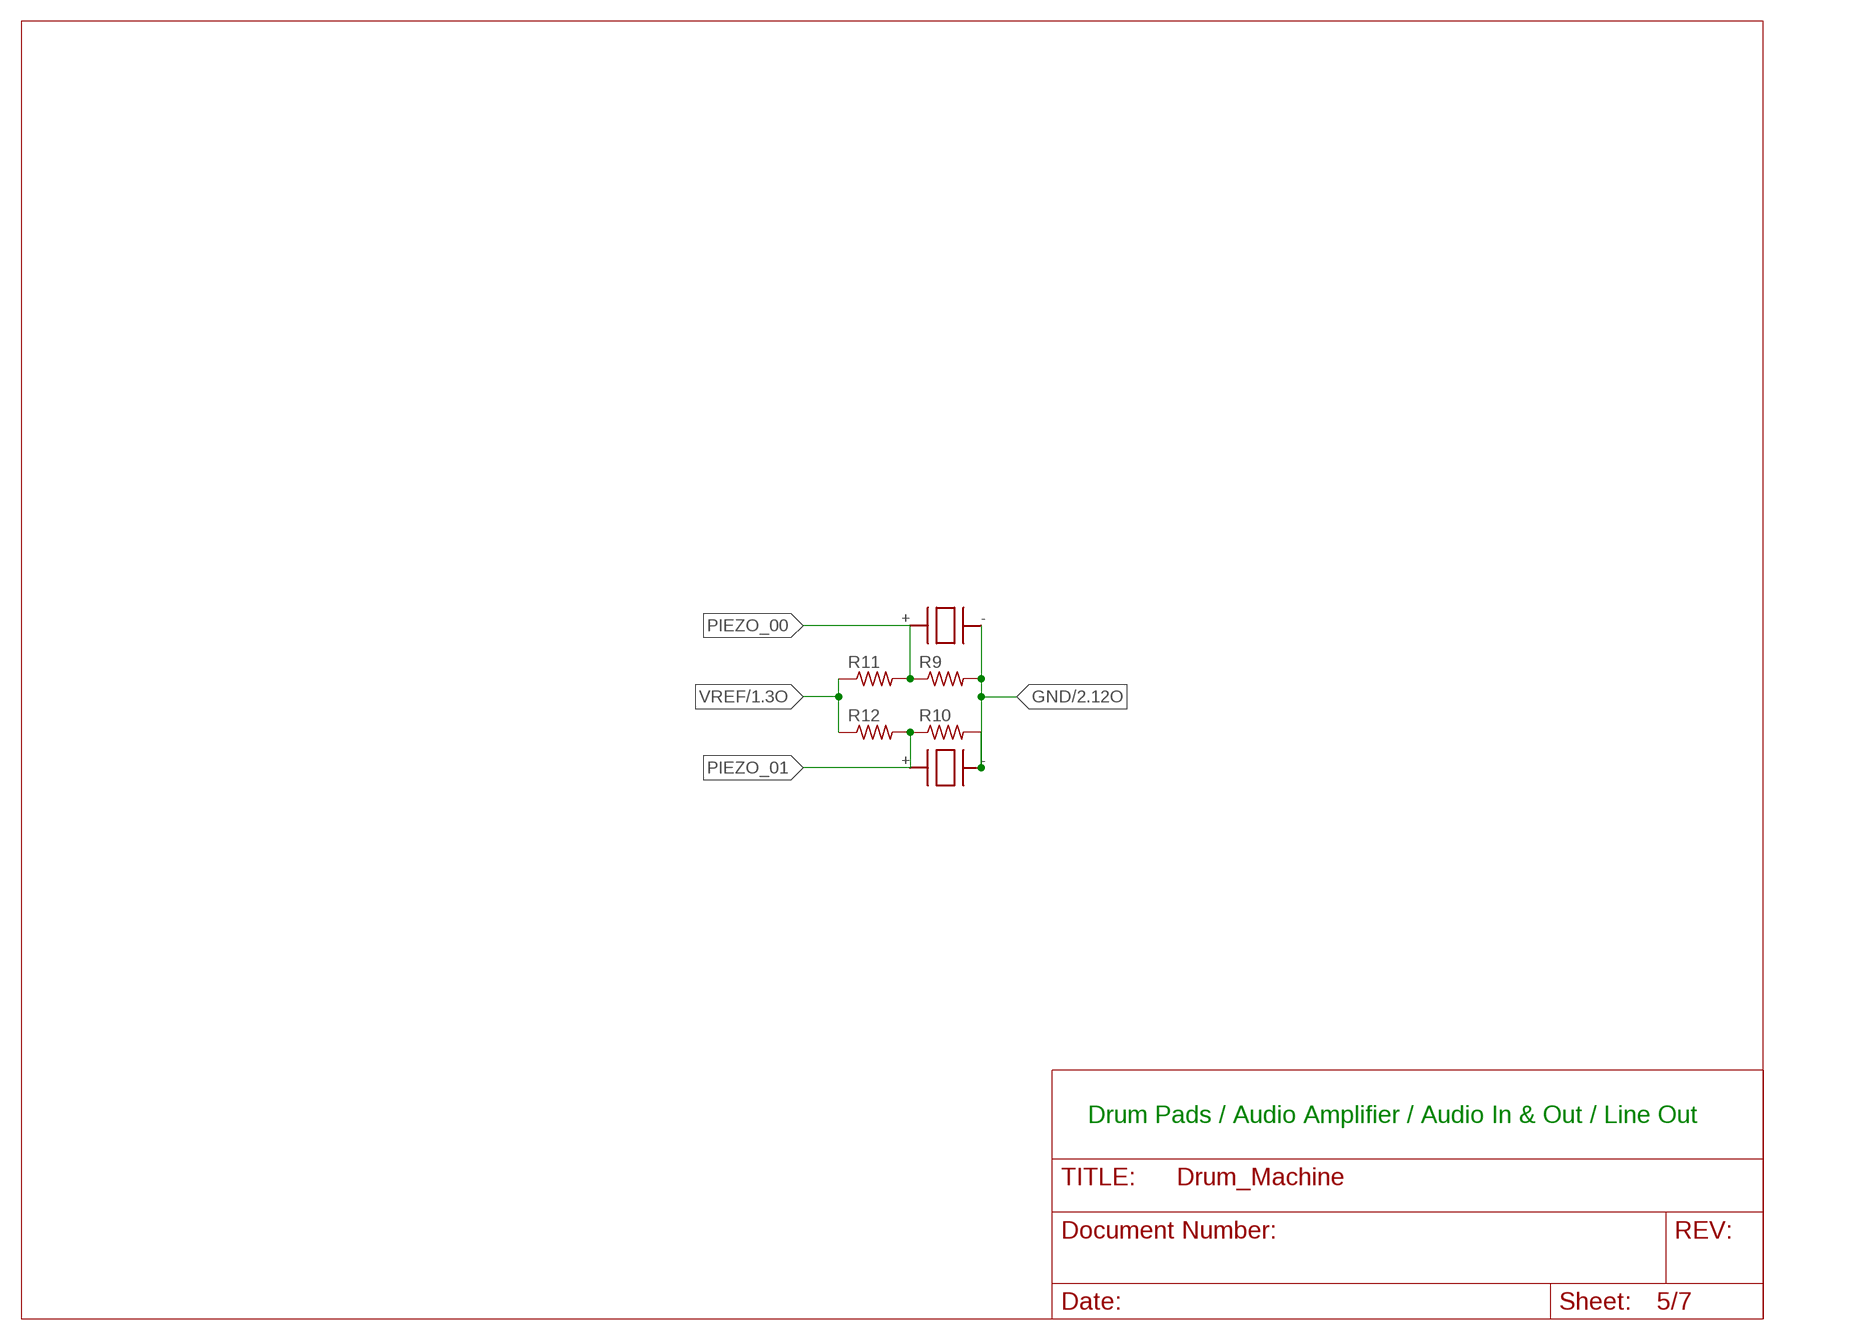
[diagram p4: schematic, sheet 5]

### Parts
R9  R-US_0204/5  [0204/5]
R10  R-US_0204/5  [0204/5]
R11  R-US_0204/5  [0204/5]
R12  R-US_0204/5  [0204/5]
U$1  TRANSDUCER  [DIAPHRAGM]
U$2  TRANSDUCER  [DIAPHRAGM]

### Nets
GND: R9.2 R10.2 U$1.- U$2.- ; also sheet 1,2,3,4,6
PIEZO_00: R9.1 R11.2 U$2.+ ; also sheet 1
PIEZO_01: R10.1 R12.2 U$1.+ ; also sheet 1
VREF: R11.1 R12.1 ; also sheet 1

### Notes on the sheet
- Drum Pads / Audio Amplifier / Audio In & Out / Line Out

## Sheet 6 of 7: Power Supply
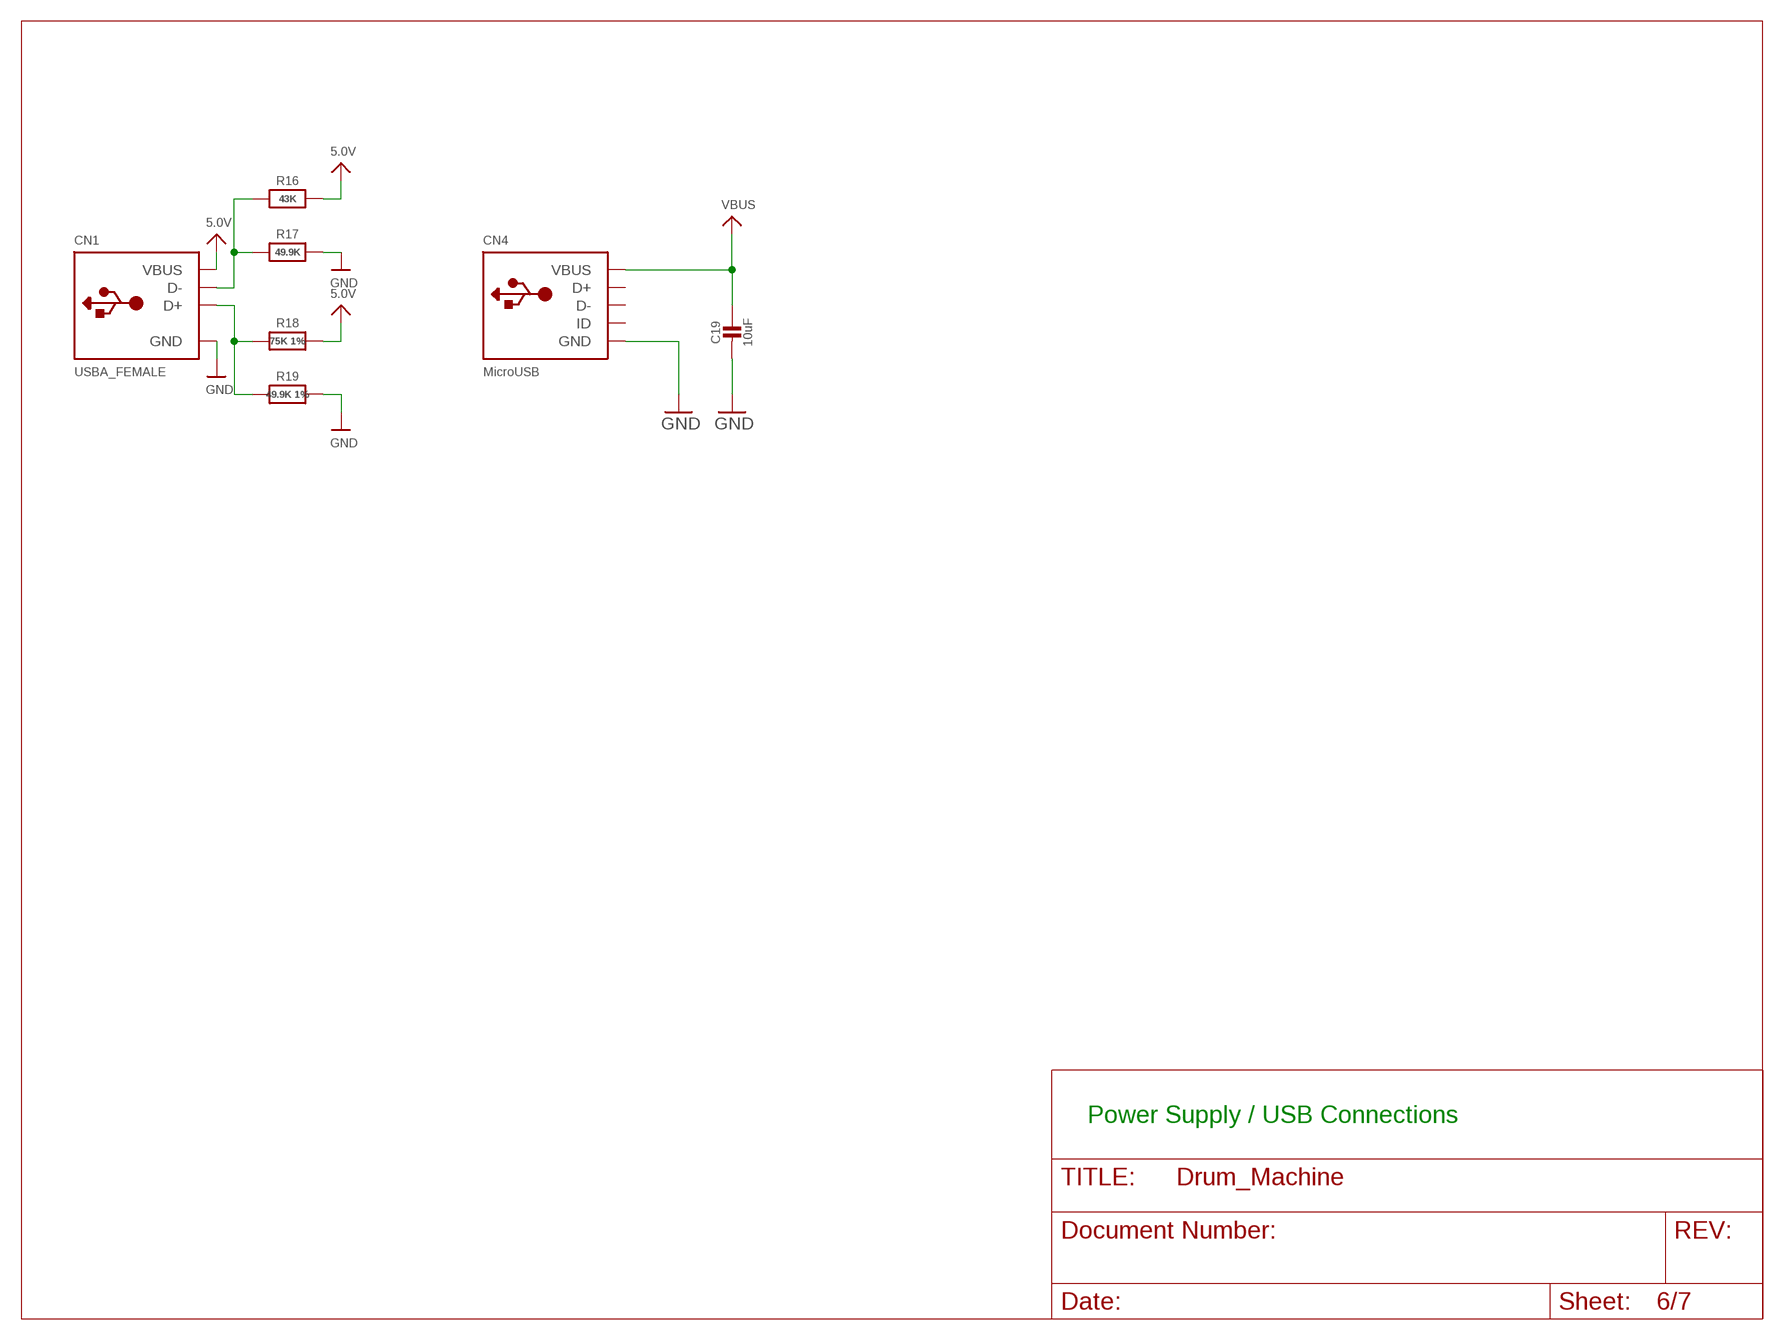
[diagram p5: schematic, sheet 6]

### Parts
C19  10uF  CAP_CERAMIC0805-NOOUTLINE  [0805-NO]
CN1  USBA_FEMALE  USB_TYPEAPTHFML  [USB_HOST-PTH]
CN4  MicroUSB  USBMICRO_20329  [4UCONN_20329]
R16  43K  RESISTOR0805_NOOUTLINE  [0805-NO]
R17  49.9K  RESISTOR0805_NOOUTLINE  [0805-NO]
R18  75K 1%  RESISTOR0805_NOOUTLINE  [0805-NO]
R19  49.9K 1%  RESISTOR0805_NOOUTLINE  [0805-NO]

### Nets
5.0V: CN1.VBUS R16.2 R18.2
D+1: CN1.D+ R18.1 R19.1
D-1: CN1.D- R16.1 R17.1
GND: C19.2 CN1.GND CN4.BASE@1(GND) CN4.BASE@2(GND) CN4.GND CN4.SPRT@1(GND) CN4.SPRT@2(GND) CN4.SPRT@3(GND) CN4.SPRT@4(GND) R17.2 R19.2 ; also sheet 1,2,3,4,5
VBUS: C19.1 CN4.VBUS
Unconnected: CN4.D+ CN4.D- CN4.ID

### Notes on the sheet
- Power Supply / USB Connections

## Sheet 7 of 7: Board Interconnects
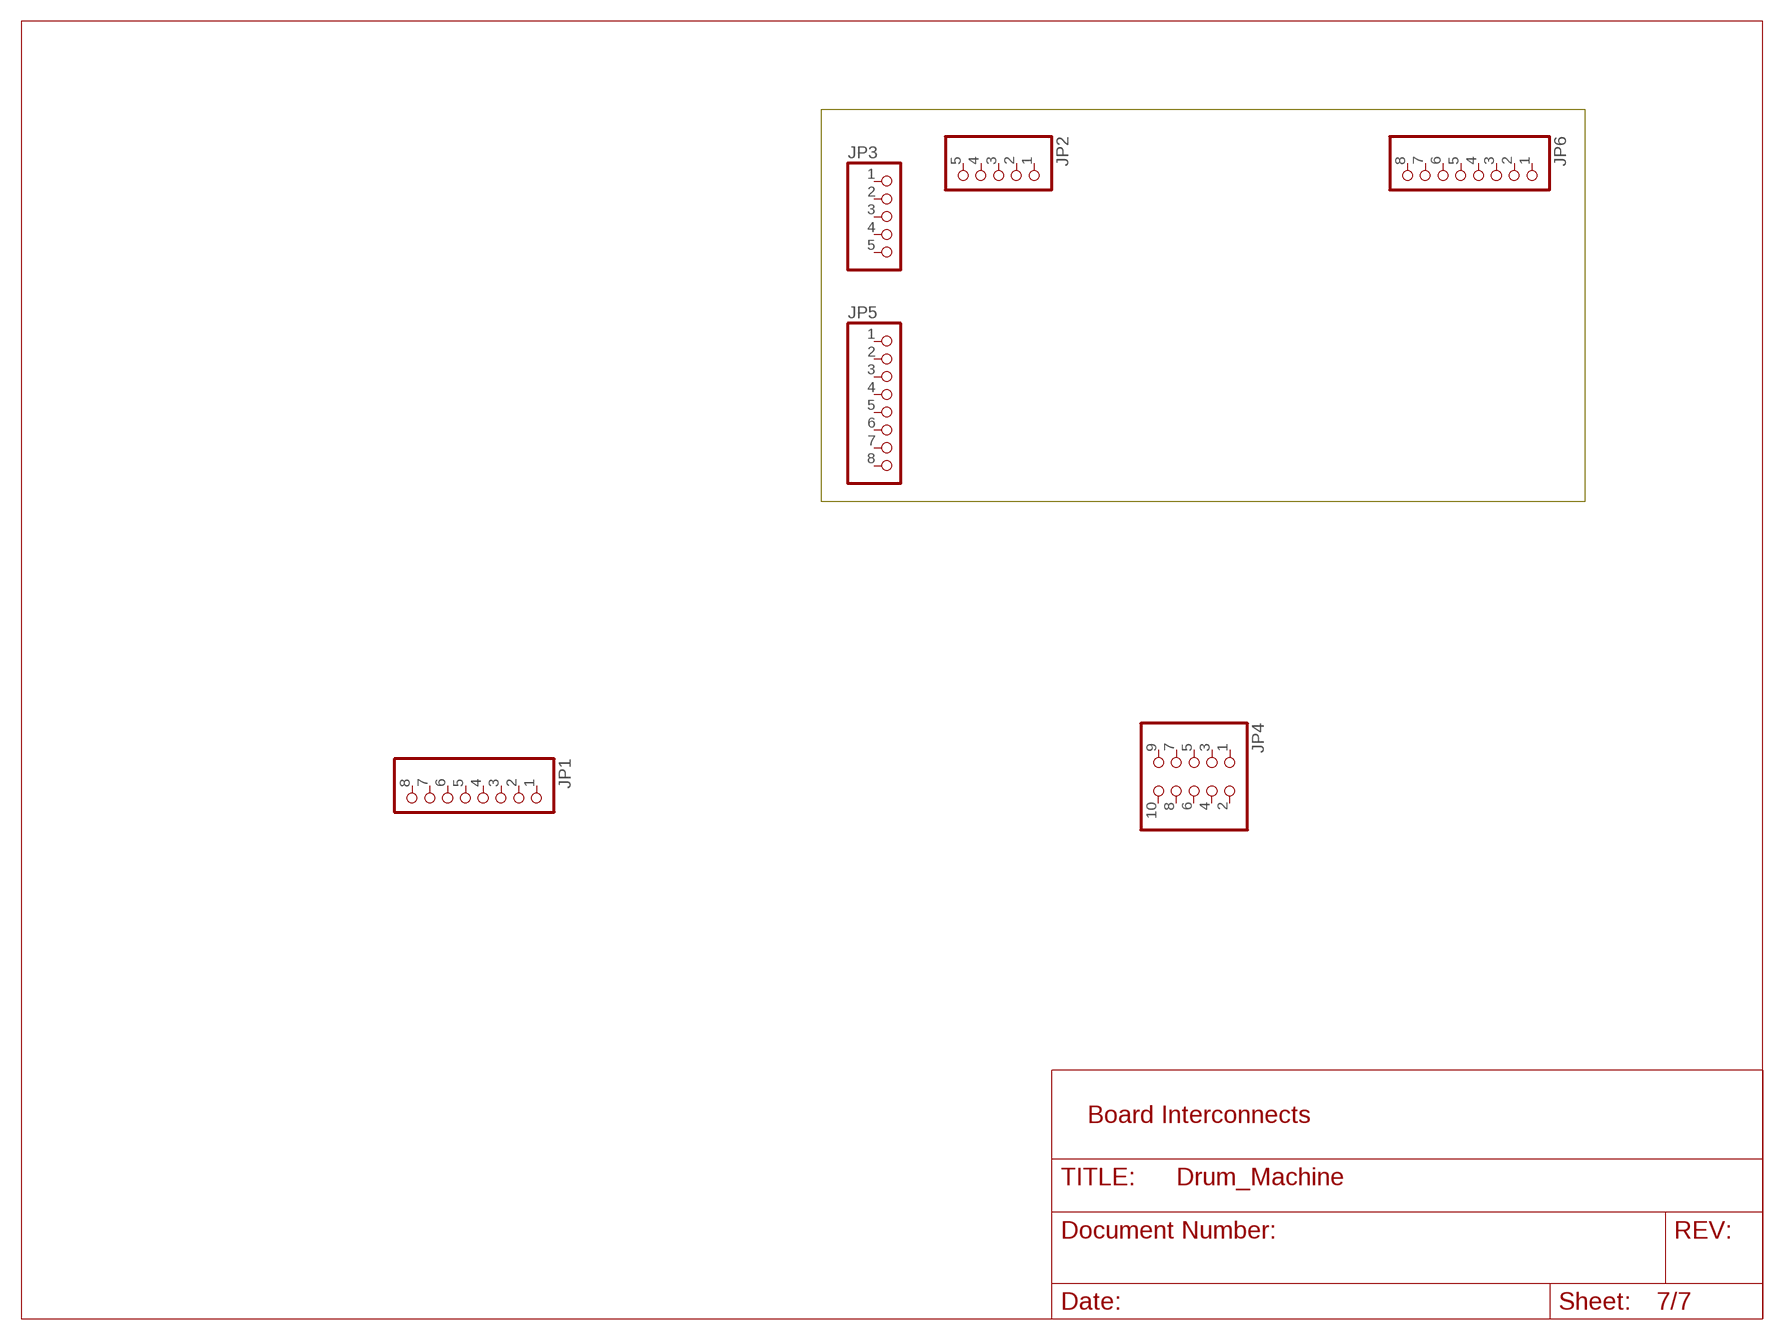
[diagram p6: schematic, sheet 7]

### Parts
JP1  PINHD-1X8-3.5MM  [1X08-3.5MM]
JP2  PINHD-1X5/90  [1X05/90]
JP3  PINHD-1X5/90  [1X05/90]
JP4  PINHD-2X5/90  [2X05/90]
JP5  PINHD-1X8/90  [1X08/90]
JP6  PINHD-1X8/90  [1X08/90]
Unconnected: JP1.1 JP1.2 JP1.3 JP1.4 JP1.5 JP1.6 JP1.7 JP1.8 JP2.1 JP2.2 JP2.3 JP2.4 JP2.5 JP3.1 JP3.2 JP3.3 JP3.4 JP3.5 JP4.1 JP4.2 JP4.3 JP4.4 JP4.5 JP4.6 JP4.7 JP4.8 JP4.9 JP4.10 JP5.1 JP5.2 JP5.3 JP5.4 JP5.5 JP5.6 JP5.7 JP5.8 JP6.1 JP6.2 JP6.3 JP6.4 JP6.5 JP6.6 JP6.7 JP6.8

### Notes on the sheet
- Board Interconnects

## Library data of the parts
C5 = resistor:C-US: CAPACITOR, American symbol
C19 = microbuilder:CAP_CERAMIC: Ceramic Capacitors For new designs, use the packages preceded by an '_' character since they are more reliable: The following footprints should be used on most boards: _0402 - Standard footprint for regular board layouts _0603 - Standard footprint for regular board layouts _0805 - Standard footprint for regular board layouts _1206 - Standard footprint for regular board layouts For extremely tight-pitch boards where space is at a premium, the following 'micro-pitch' footprints can be used (smaller pads, no silkscreen outline, etc.): _0402MP - Micro-pitch footprint for very dense/compact boards _0603MP - Micro-pitch footprint for very dense/compact boards _0805MP - Micro-pitch footprint for very dense/compact boards _1206MP - Micro-pitch footprint for very dense/compact boards
CN1 = microbuilder:USB_TYPEA: USB - Type A Connectors Male types stick out and are inserted into a PC or matching females parts (these are the connectors used on USB Memory Sticks, etc.). Female parts are generally used for USB Host and accept a male-type connector. SMT - 4UCON: 10017 PTHFML - Digikey: 609-1045-ND, 4UCon: 05241 PCB - Use 2.0mm thick PCBs with this footprint
CN4 = microbuilder:USB: USB Connectors USBMINIB - Surface Mount Female Mini-B USB Connector 4UConnector: 06564
D1-D24 D29-D32 D35-D37 D39 D41-D46 = diode:PMLL4150: DIODE high speed
D40 = SparkFun-LED:LED-RG; PROD_ID: DIO-12140
E1 = SparkFun-Switches:ENCODER-SWITCH: Rotary Encoder w/ Select Switch Encoders rotate similarly to potentiometers, but they’re different from potentiometers in that an encoder has full rotation without limits. They output gray code so that you can tell how much and in which direction the encoder has been turned. This encoder includes a push-down select switch built into the shaft. SparkFun Products Rotary Encoder <https://www.sparkfun.com/products/9117> (COM-09117); SF_SKU: COM-09117
E2-E4 = SparkFun-Switches:ENCODER: Rotary Encoder Encoders rotate similarly to potentiometers, but they’re different from potentiometers in that an encoder has full rotation without limits. They output gray code so that you can tell how much and in which direction the encoder has been turned. SparkFun Products Used on the https://www.sparkfun.com/products/11043 (COM-11043); PROD_ID: RES-11299
IC1-IC4 = Hex Game:74*595: 8-bit SHIFT REGISTER, output latch
IC9 = 74xx-us:74*165: 8-bit parallel load SHIFT REGISTER
J1 = SparkFun-Connectors:USB: USB Connectors USB-B-PTH is fully proven SKU : PRT-00139/CONN-08278 USB-miniB is fully proven SKU : PRT-00587 USB-A-PCB is untested. USB-A-H is throughly reviewed, but untested. Spark Fun Electronics SKU : PRT-00437 USB-B-SMT is throughly reviewed, but untested. Needs silkscreen touching up. USB-A-S has not been used/tested USB-MB-H has not been used/tested USB-MICROB has been used. CONN-09505; PROD_ID: CONN-09520
J2 = SparkFun-Connectors:M10: Header 10 Standard 10-pin 0.1" header. Use with straight break away headers (SKU : PRT-00116), right angle break away headers (PRT-00553), swiss pins (PRT-00743), machine pins (PRT-00117), and female headers (PRT-00115).; PROD_ID: CONN-11563
J5 J6 = con-molex:22-23-2031: .100" (2.54mm) Center Header - 3 Pin; MF: MOLEX; MPN: 22-23-2031; OC_FARNELL: 1462950; OC_NEWARK: 30C0862
JP1 = adafruit:PINHD-1X8: PIN HEADER
JP2 JP3 = pinhead:PINHD-1X5: PIN HEADER
JP4 = pinhead:PINHD-2X5: PIN HEADER
JP5 JP6 = pinhead:PINHD-1X8: PIN HEADER
LED9-LED64 = Hex Game:LED: LED OSRAM: - CHIPLED LG R971, LG N971, LY N971, LG Q971, LY Q971, LO R971, LY R971 LH N974, LH R974 LS Q976, LO Q976, LY Q976 LO Q996 - Hyper CHIPLED LW Q18S LB Q993, LB Q99A, LB R99A - SideLED LS A670, LO A670, LY A670, LG A670, LP A670 LB A673, LV A673, LT A673, LW A673 LH A674 LY A675 LS A676, LA A676, LO A676, LY A676, LW A676 LS A679, LY A679, LG A679 - Hyper Micro SIDELED® LS Y876, LA Y876, LO Y876, LY Y876 LT Y87S - SmartLED LW L88C, LW L88S LB L89C, LB L89S, LG L890 LS L89K, LO L89K, LY L89K LS L896, LA L896, LO L896, LY L896 - TOPLED LS T670, LO T670, LY T670, LG T670, LP T670 LSG T670, LSP T670, LSY T670, LOP T670, LYG T670 LG T671, LOG T671, LSG T671 LB T673, LV T673, LT T673, LW T673 LH T674 LS T676, LA T676, LO T676, LY T676, LB T676, LH T676, LSB T676, LW T676 LB T67C, LV T67C, LT T67C, LS T67K, LO T67K, LY T67K, LW E67C LS E67B, LA E67B, LO E67B, LY E67B, LB E67C, LV E67C, LT E67C LW T67C LS T679, LY T679, LG T679 LS T770, LO T770, LY T770, LG T770, LP T770 LB T773, LV T773, LT T773, LW T773 LH T774 LS E675, LA E675, LY E675, LS T675 LS T776, LA T776, LO T776, LY T776, LB T776 LHGB T686 LT T68C, LB T68C - Hyper Mini TOPLED® LB M676 - Mini TOPLED Santana® LG M470 LS M47K, LO M47K, LY M47K Source: http://www.osram.convergy.de LUXEON: - LUMILED® LXK2-PW12-R00, LXK2-PW12-S00, LXK2-PW14-U00, LXK2-PW14-V00 LXK2-PM12-R00, LXK2-PM12-S00, LXK2-PM14-U00 LXK2-PE12-Q00, LXK2-PE12-R00, LXK2-PE12-S00, LXK2-PE14-T00, LXK2-PE14-U00 LXK2-PB12-K00, LXK2-PB12-L00, LXK2-PB12-M00, LXK2-PB14-N00, LXK2-PB14-P00, LXK2-PB14-Q00 LXK2-PR12-L00, LXK2-PR12-M00, LXK2-PR14-Q00, LXK2-PR14-R00 LXK2-PD12-Q00, LXK2-PD12-R00, LXK2-PD12-S00 LXK2-PH12-R00, LXK2-PH12-S00 LXK2-PL12-P00, LXK2-PL12-Q00, LXK2-PL12-R00 Source: www.luxeon.com KINGBRIGHT: KA-3528ASYC Source: www.kingbright.com
LED129 = display-kingbright:B?56-12*WA: 14.22mm (0.56INCH) THREE DIGIT NUMERIC DISPLAY Source: http://www.kingbright.com .. BA56-11EWA(Ver1189474895.pdf; OC_FARNELL: unknown; OC_NEWARK: unknown
P1 P2 = pinhead:PINHD-2X18: PIN HEADER
PLAY RECORD SAMPLE_01-SAMPLE_06 STEP_01-STEP_09 STEP_10-STEP_16 STOP = microbuilder:SWITCH_TACT_SMT: SMT Tact Switches 6x6mm - Digikey: P12940SCT-ND KMR2 (4.6x2.8mm) - Digikey: 401-1426-1-ND EVQ-PQHB55 - Light Touch, 160GF (4.5x4.5mm) - Digikey: P8090SCT-ND
Q00 Q01-Q07 Q16-Q18 Q27-Q34 = transistor-pnp:BC857*: PNP Transistror
Q08 Q09 Q10-Q15 Q19-Q26 = transistor-neu-to92:*-NPN-: NPN Transistror
R1-R8 R29-R100 R103-R118 R120 R121 R201-R228 = Hex Game:R-US_: RESISTOR, American symbol
R9-R12 = adafruit:R-US_: RESISTOR, American symbol
R16-R19 = microbuilder:RESISTOR: Resistors For new designs, use the packages preceded by an '_' character since they are more reliable: The following footprints should be used on most boards: _0402 - Standard footprint for regular board layouts _0603 - Standard footprint for regular board layouts _0805 - Standard footprint for regular board layouts _1206 - Standard footprint for regular board layouts For extremely tight-pitch boards where space is at a premium, the following 'micro-pitch' footprints can be used (smaller pads, no silkscreen outline, etc.): _0402MP - Micro-pitch footprint for very dense/compact boards _0603MP - Micro-pitch footprint for very dense/compact boards _0805MP - Micro-pitch footprint for very dense/compact boards _1206MP - Micro-pitch footprint for very dense/compact boards
R101 R102 = rcl:R-EU_: RESISTOR, European symbol; MANEX: 110-0002014
STEP_A STEP_B STEP_C STEP_D = switch:320-916: TOGGLE SWITCH distributor RS Components
U$1 U$2 = Drum_Machine_V00:TRANSDUCER